# Altium schematic sheet JTAG.schdoc
size Tabloid
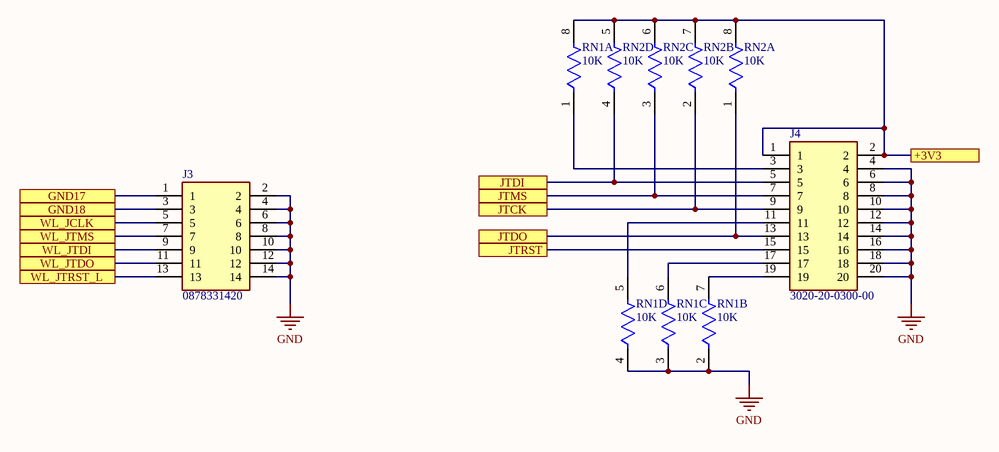
[diagram p0: JTAG.schdoc]

## Parts
J3  0878331420  [SHDRRA14W55P200_2X7_1665X640X630P]
J4  3020-20-0300-00  [302020030000]
RN1  10K  [FP-CAT16-F4-MFG]  (parts A,B,C,D of 4)
RN2  10K  [FP-CAT16-F4-MFG]  (parts A,B,C,D of 4)

## Ports
+3V3, GND17, GND18, JTCK, JTDI, JTDO, JTMS, JTRST, WL_JCLK, WL_JTDI, WL_JTDO, WL_JTMS, WL_JTRST_L

## Nets
GND: J3.2 J3.4 J3.6 J3.8 J3.10 J3.12 J3.14 J4.4 J4.6 J4.8 J4.10 J4.12 J4.14 J4.16 J4.18 J4.20 RN1.2 RN1.3 RN1.4
+3V3: J4.1 J4.2 RN1.8 RN2.5 RN2.6 RN2.7 RN2.8 ; port +3V3
GND17: J3.1 ; port GND17
GND18: J3.3 ; port GND18
JTCK: J4.9 RN2.2 ; port JTCK
JTDI: J4.5 RN2.4 ; port JTDI
JTDO: J4.13 RN2.1 ; port JTDO
JTMS: J4.7 RN2.3 ; port JTMS
JTRST: J4.15 ; port JTRST
WL_JCLK: J3.5 ; port WL_JCLK
WL_JTDI: J3.9 ; port WL_JTDI
WL_JTDO: J3.11 ; port WL_JTDO
WL_JTMS: J3.7 ; port WL_JTMS
WL_JTRST_L: J3.13 ; port WL_JTRST_L
NetJ4_3: J4.3 RN1.1
NetJ4_11: J4.11 RN1.5
NetJ4_17: J4.17 RN1.6
NetJ4_19: J4.19 RN1.7

## Notes on the sheet
- Title
- Size:
- Date:
- Tabloid
- Number:
- Time:
- Revision:
- Sheet
- of
- File:

## Library data of the parts
J3 = 0878331420: Connector; Manufacturer_Name: Molex; Datasheet Link: https://www.molex.com/pdm_docs/sd/878331420_sd.pdf; Height: 6.3mm; Manufacturer_Part_Number: 0878331420; Mouser Part Number: N/A; Mouser Price/Stock: https://www.mouser.co.uk/ProductDetail/Molex/0878331420?qs=PBcRNPEHKsow9zM36KXngg%3D%3D; Arrow Part Number: 0878331420; Arrow Price/Stock: https://www.arrow.com/en/products/0878331420/molex
J4 = 3020-20-0300-00: Connector; Manufacturer_Name: CNC Tech; Datasheet Link: http://cnctech.us/pdfs/3020-XX-0300-00.pdf; Height: 9mm; Manufacturer_Part_Number: 3020-20-0300-00; Arrow Part Number: 3020-20-0300-00; Arrow Price/Stock: https://www.arrow.com/en/products/3020-20-0300-00/cnc-tech-llc
RN1 RN2 = CMP-07230-000003-1: RES ARRAY 4 RES 10K OHM 1206; Manufacturer Part Number: CAT16-1002F4LF; Manufacturer: Bourns; Resistance: 10kΩ; Voltage Rating: 50V; Power Rating: 0.25W; Tolerance: 1%; Number Of Resistors: 4; Value: 10kΩ; Temperature Coefficient: 200ppm/°C; Description: Res Thick Film Array 10K Ohm 1% ISOL Molded 8-Pin 1206 Concave SMD Paper T/R; Power Per Resistor: 0.0625W; Category: Res; Termination: Concave; Series: CAT16; Height: 0.6mm; Device Class L2: Resistors; Digikey Description: RES ARRAY 4 RES 10K OHM 1206; ComponentLink2Description: Datasheet; Temperature Range High: +125°C; ComponentLink2URL: https://www.bourns.com/docs/Product-Datasheets/CATCAY.pdf; Temperature: -55°C to +125°C; Temperature Range Low: -55°C; Octopart: https://octopart.com/cat16-1002f4lf-bourns-1624551; Mouser Description: Resistor Networks & Arrays 10K 1% Concave 4resistors; RoHS: TRUE; Device Class L1: Passive Components; Lead Free: Yes; Automotive: No; Package: CAT16-F4; Device Class L3: Resistor Arrays